# Altium project 2001A_walkie_talkie.PrjPCB
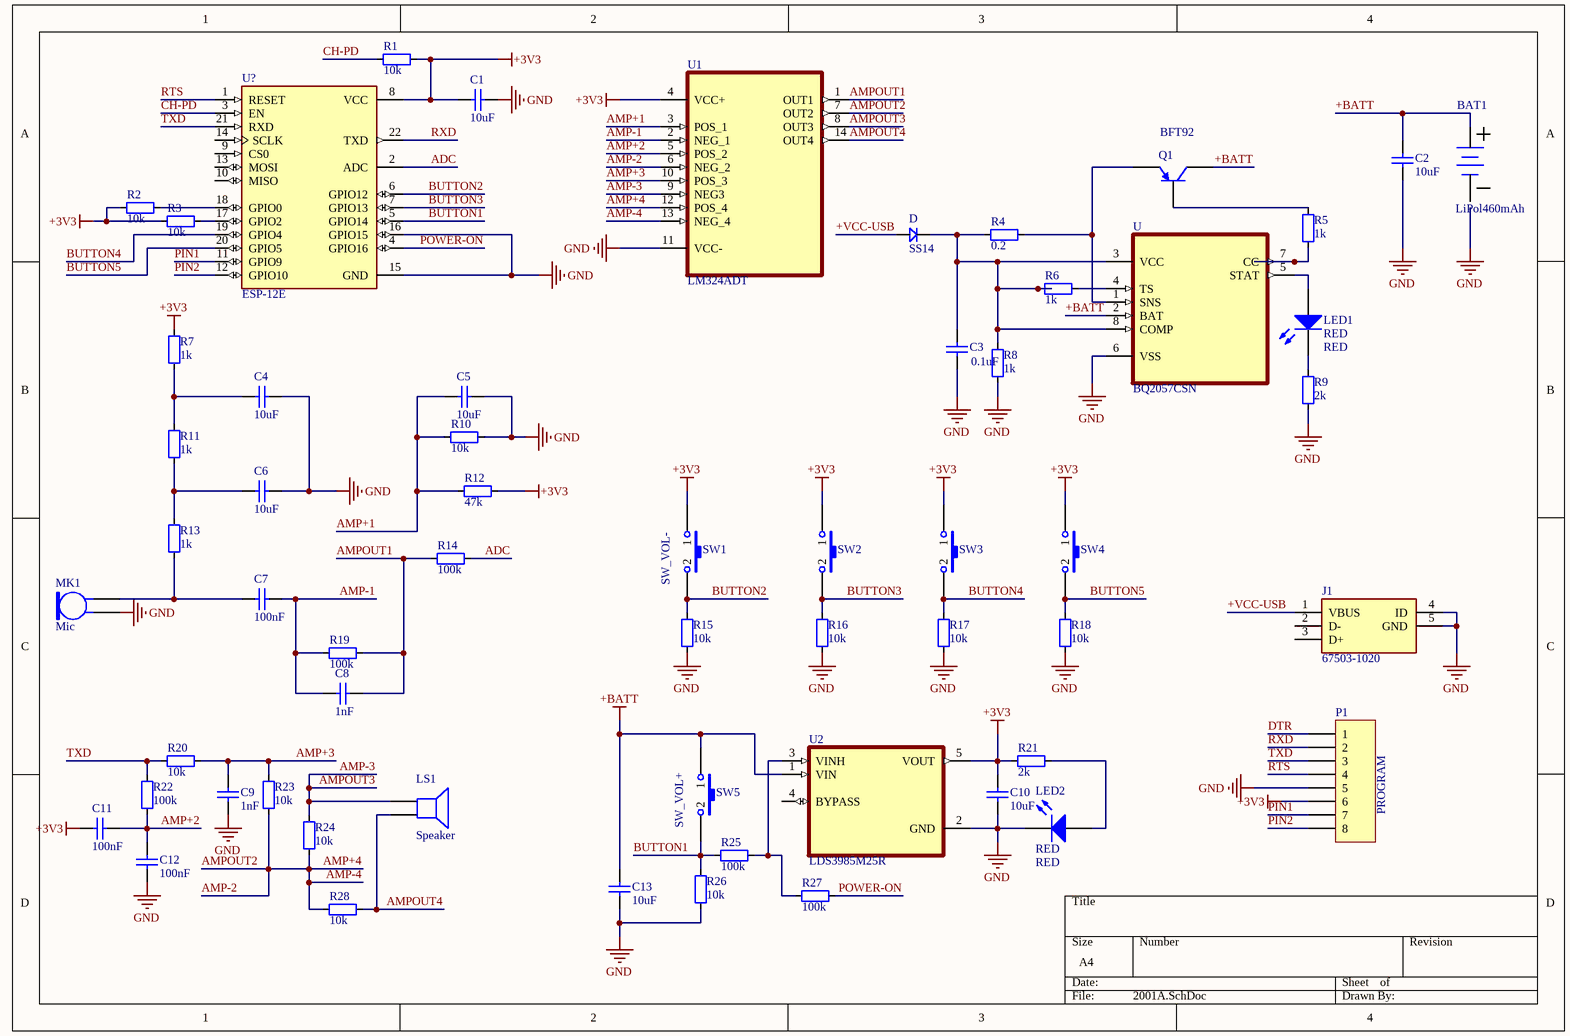
[diagram p0: 2001A.SchDoc]
1 sheet, 59 parts. Net scope: global (net labels, ports and power ports of the same name join across sheets).

## Sheet 2001A.SchDoc
size A4

### Parts
BAT1  LiPol460mAh  [LiPol_460mAh]
C1  value 10uF  [0603_CAP]  (hidden comment: Cap)
C2  value 10uF  [0603_CAP]  (hidden comment: Cap)
C3  value 0.1uF  [0603_CAP]  (hidden comment: Cap)
C4  value 10uF  [0603_CAP]  (hidden comment: Cap)
C5  value 10uF  [0603_CAP]  (hidden comment: Cap)
C6  value 10uF  [0603_CAP]  (hidden comment: Cap)
C7  value 100nF  [0603_CAP]  (hidden comment: Cap)
C8  value 1nF  [0603_CAP]  (hidden comment: Cap)
C9  value 1nF  [0603_CAP]  (hidden comment: Cap)
C10  value 10uF  [0603_CAP]  (hidden comment: Cap)
C11  value 100nF  [0603_CAP]  (hidden comment: Cap)
C12  value 100nF  [0603_CAP]  (hidden comment: Cap)
C13  value 10uF  [0603_CAP]  (hidden comment: Cap)
D  SS14  [DO214]
ESP-12E  U?  [XCVR_ESP8266-12E/ESP-12E]
J1  67503-1020  [67503-1020]
LED1  RED  [LED_THT_RED]
LED2  RED  [0603]
LS1  Speaker  [PIN2]
MK1  Mic  [PIN2]
P1  PROGRAM  [HDR1X8]
Q1  BFT92  [SOT23-3]
R1  10k  [0603]
R2  10k  [0603]
R3  10k  [0603]
R4  0.2  [0805]
R5  1k  [0603]
R6  1k  [0603]
R7  1k  [0603]
R8  1k  [0603]
R9  2k  [0603]
R10  10k  [0603]
R11  1k  [0603]
R12  47k  [0603]
R13  1k  [0603]
R14  100k  [0603]
R15  10k  [0603]
R16  10k  [0603]
R17  10k  [0603]
R18  10k  [0603]
R19  100k  [0603]
R20  10k  [0603]
R21  2k  [0603]
R22  100k  [0603]
R23  10k  [0603]
R24  10k  [0603]
R25  100k  [0603]
R26  10k  [0603]
R27  100k  [0603]
R28  10k  [0603]
SW1  SW_VOL-  [Micro_Switch]
SW2  SW_VOL-  [Micro_Switch]  (value not drawn)
SW3  SW_VOL-  [Micro_Switch]  (value not drawn)
SW4  SW_VOL-  [Micro_Switch]  (value not drawn)
SW5  SW_VOL+  [Micro_Switch]
U  BQ2057CSN  [SOIC127P600X175-8N]
U1  LM324ADT  [SOIC127P600X175-14N]
U2  LDS3985M25R  [SOIC127P600X175-14N]

### Nets
+3V3: C1.1 C10.2 C11.1 ESP-12E.8(VCC) P1.6 R1.2 R2.1 R3.1 R7.1 R12.2 R21.2 SW1.1 SW2.1 SW3.1 SW4.1 U1.4(VCC+) U2.5(VOUT)
+BATT: C2.2 C13.2 Q1.3(C) SW5.1 U.2(BAT) U2.1(VIN)
GND: C1.2 C2.1 C3.1 C4.2 C5.2 C6.2 C9.1 C10.1 C12.1 C13.1 ESP-12E.15(GND) ESP-12E.16(GPIO15) J1.4(ID) J1.5(GND) LED2.2(K) MK1.1 P1.5 R8.2 R9.2 R10.2 R15.2 R16.2 R17.2 R18.2 R26.1 U.6(VSS) U1.11(VCC-) U2.2(GND)
+VCC-USB: D.ANODE J1.1(VBUS)
ADC: ESP-12E.2(ADC) R14.2
AMP+1: C5.1 R10.1 R12.1 U1.3(POS_1)
AMP+2: C11.2 C12.2 R22.1 U1.5(POS_2)
AMP+3: C9.2 R20.2 R23.2 U1.10(POS_3)
AMP+4: R23.1 R24.1 R28.1 U1.6(NEG_2) U1.7(OUT2) U1.12(POS_4) U1.13(NEG_4)  [also labelled AMP-2, AMP-4, AMPOUT2]
AMP-1: C7.2 C8.1 R19.1 U1.2(NEG_1)
AMP-3: LS1.1 R24.2 U1.8(OUT3) U1.9(NEG3)  [also labelled AMPOUT3]
AMPOUT1: C8.2 R14.1 R19.2 U1.1(OUT1)
AMPOUT4: LS1.2 R28.2 U1.14(OUT4)
BUTTON1: ESP-12E.5(GPIO14) R25.2 R26.2 SW5.2
BUTTON2: ESP-12E.6(GPIO12) R15.1 SW1.2
BUTTON3: ESP-12E.7(GPIO13) R16.1 SW2.2
BUTTON4: ESP-12E.19(GPIO4) R17.1 SW3.2
BUTTON5: ESP-12E.20(GPIO5) R18.1 SW4.2
CH-PD: ESP-12E.3(EN) R1.1
DTR: P1.1
PIN1: ESP-12E.11(GPIO9) P1.7
PIN2: ESP-12E.12(GPIO10) P1.8
POWER-ON: ESP-12E.4(GPIO16) R27.1
RTS: ESP-12E.1(RESET) P1.4
RXD: ESP-12E.22(TXD) P1.2
TXD: ESP-12E.21(RXD) P1.3 R20.1 R22.2
NetC3_2: C3.2 D.CATHODE(KATHODE) R4.1 R6.1 R8.1 U.3(VCC) U.8(COMP)
NetC4_1: C4.1 R7.2 R11.1
NetC6_1: C6.1 R11.2 R13.1
NetC7_1: C7.1 MK1.2 R13.2
NetESP-12E_17: ESP-12E.17(GPIO2) R3.2
NetESP-12E_18: ESP-12E.18(GPIO0) R2.2
NetLED1_1: LED1.1(A) U.5(STAT)
NetLED1_2: LED1.2(K) R9.1
NetLED2_1: LED2.1(A) R21.1
NetQ1_1: Q1.1(E) R4.2 U.1(SNS)
NetQ1_2: Q1.2(B) R5.1
NetR5_2: R5.2 U.7(CC)
NetR6_2: R6.2 U.4(TS)
NetR25_1: R25.1 R27.2 U2.3(VINH)

Not connected (* = marked no-connect by the designer): ESP-12E 9(CS0) 10(MISO) 13(MOSI) 14(SCLK); J1 2(D-) 3(D+); U2 4(BYPASS)

### Library data of the parts
BAT1 = Battery
C1-C13 = Cap: Ceramic capacitor; Unit Price1: *; Unit Price2: *
D = SS14: Diode Schottky 40V 1A Surface Mount SMA _DO-214AC_; MF: ON Semiconductor; Availability: Unavailable; MP: SS14; Price: None; Value: *; SnapEDA_Link: https://www.snapeda.com/parts/SS14/ON%20Semiconductor/view-part/1413348/?ref=snap; Package: DO-214AC-214 ON Semiconductor
ESP-12E = ESP8266-12E/ESP-12E: This WiFi module has a 32-bit MCU micro and clock speeds supporting 80 MHz or 160 MHz. Supports the RTOS and integrated Wi-Fi MAC/BB/RF/PA/LNA, and has an on-board antenna.; MF: AI-Thinker; Price: None; Package: None; Value: U?; MP: ESP8266-12E/ESP-12E; Availability: Unavailable; SnapEDA_Link: https://www.snapeda.com/parts/ESP8266-12E/ESP-12E/AI-Thinker/view-part/106414/?ref=snap
J1 = 67503-1020: Connector; Manufacturer_Name: Molex; Datasheet Link: http://docs-emea.rs-online.com/webdocs/13c4/0900766b813c46de.pdf; Manufacturer_Part_Number: 67503-1020; Mouser Part Number: 538-67503-1020; Mouser Price/Stock: https://www.mouser.com/Search/Refine.aspx?Keyword=538-67503-1020; RS Part Number: 1891440; RS Price/Stock: http://uk.rs-online.com/web/p/products/1891440
LED1 LED2 = LED: Light-emitting diode; COLOR: RED
LS1 = Speaker: Loudspeaker; Published: 24-Mar-1999; LatestRevisionDate: 17-Jul-2002; LatestRevisionNote: Re-released for DXP Platform.; PackageReference: PIN2; Publisher: Altium Limited
MK1 = Mic2: Microphone; Published: 24-Mar-1999; LatestRevisionDate: 17-Jul-2002; LatestRevisionNote: Re-released for DXP Platform.; PackageReference: PIN2; Publisher: Altium Limited
P1 = HDR1X8: Header, 8-Pin; LatestRevisionDate: 17-Jul-2002; LatestRevisionNote: Re-released for DXP Platform.; Publisher: Altium Limited
Q1 = 2N3906: PNP General Purpose Amplifier; Published: 8-Jun-2000; LatestRevisionDate: 15-Jan-2003; LatestRevisionNote: PCB Footprint 'BCY-W3/D4.7' replaced; DatasheetVersion: 1997; PackageVersion: Sep-1998; PackageReference: TO-92A; Publisher: Altium Limited; PackageDescription: TO, Flat Index; 3 In-Line, Axial Leads; Body Dia. 4.5mm; Leads 0.51 x 0.48 mm (max); ComponentLink1Description: Manufacturer Link; ComponentLink1URL: http://www.fairchildsemi.com/; ComponentLink2Description: Datasheet; ComponentLink2URL: http://www.fairchildsemi.com/ds/2N%2F2N3906.pdf
R1-R28 = RES: Resistior
  R1-R3 R10 R15-R18 R20 R23 R24 R26 R28: Value: 10k
  R4: Value: 0.2
  R5-R8 R11 R13: Value: 1k
  R9 R21: Value: 2k
  R12: Value: 47k
  R14 R19 R22 R25 R27: Value: 100k
SW1-SW5 = Micro_Switch: Switch; Published: 24-Mar-1999; LatestRevisionDate: 17-Jul-2002; LatestRevisionNote: Re-released for DXP Platform.; PackageReference: SPST-2; Publisher: Altium Limited
U = BQ2057CSN: Charger IC Lithium Ion/Polymer 8-SOIC; MF: Texas Instruments; Price: None; Package: SOIC-8 Texas Instruments; Availability: Unavailable; SnapEDA_Link: https://www.snapeda.com/parts/BQ2057CSN/Texas%20Instruments/view-part/237203/?ref=snap; Value: *; MP: BQ2057CSN
U1 = LM324ADT: LM324A Series 32 V 1.3 MHz Low Power Quad Operational Amplifier - SOIC-14; MF: STMicroelectronics; Price: None; SnapEDA_Link: https://www.snapeda.com/parts/LM324ADT/STMicroelectronics/view-part/8254/?ref=snap; Value: *; MP: LM324ADT; Package: SOIC-14 STMicroelectronics; Availability: Unavailable
U2 = LDS3985M25R: Linear Voltage Regulator IC 1 Output 300mA SOT-23-5; MF: STMicroelectronics; Price: None; Package: SOT-23-5 STMicroelectronics; Availability: Unavailable; SnapEDA_Link: https://www.snapeda.com/parts/LDS3985M25R/STMicroelectronics/view-part/611665/?ref=snap; Value: *; MP: LDS3985M25R